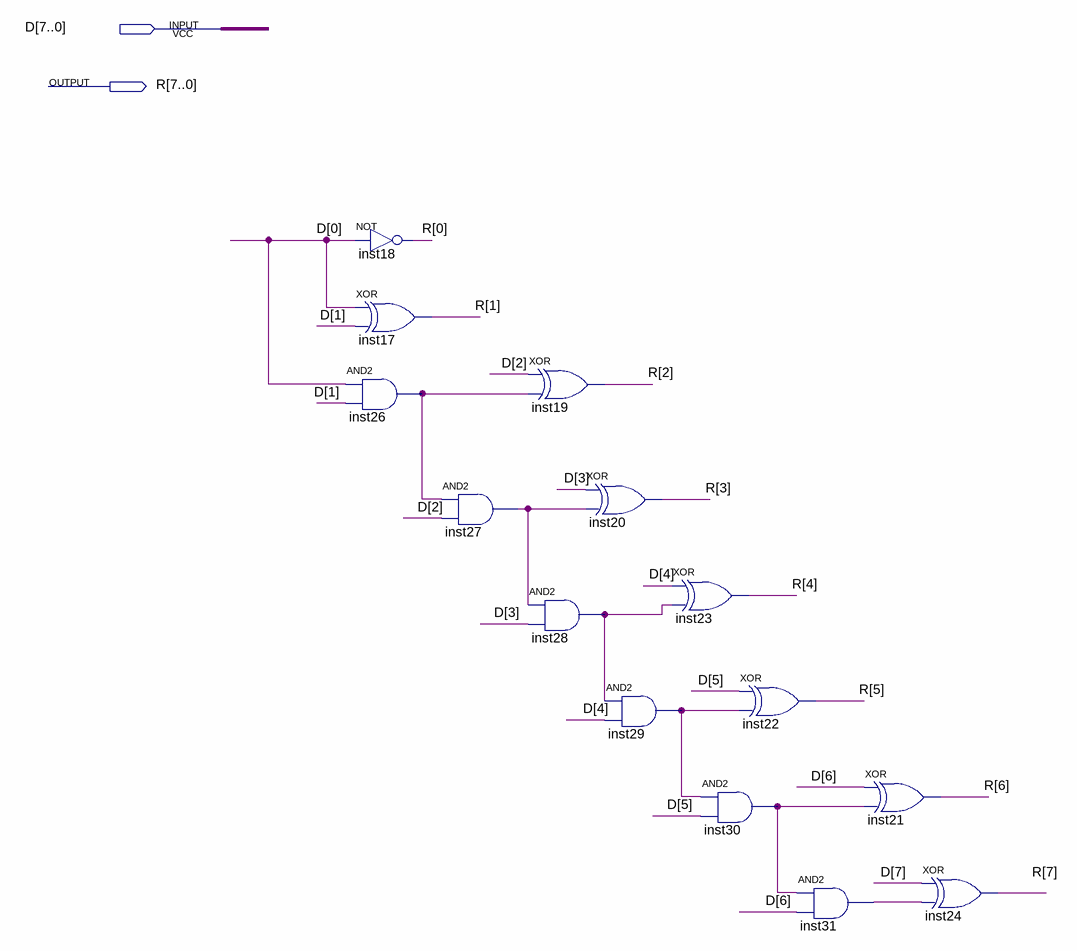
[diagram p0: schematic sheet]
// Quartus schematic Incrementador_8b.bdf as structural Verilog: 14 symbols, 2 pins
module Incrementador_8b (
  input  [7:0] D,
  output [7:0] R
);

  wire inst26_out, inst27_out, inst28_out, inst29_out, inst30_out, inst31_out;

  not inst18 (R[0], D[0]);
  xor inst17 (R[1], D[0], D[1]);
  and inst26 (inst26_out, D[0], D[1]);
  and inst27 (inst27_out, inst26_out, D[2]);
  xor inst19 (R[2], D[2], inst26_out);
  and inst28 (inst28_out, inst27_out, D[3]);
  xor inst20 (R[3], D[3], inst27_out);
  and inst29 (inst29_out, inst28_out, D[4]);
  xor inst23 (R[4], D[4], inst28_out);
  xor inst22 (R[5], D[5], inst29_out);
  and inst30 (inst30_out, inst29_out, D[5]);
  and inst31 (inst31_out, inst30_out, D[6]);
  xor inst21 (R[6], D[6], inst30_out);
  xor inst24 (R[7], D[7], inst31_out);
endmodule
